# Altium schematic sheet ISense.SchDoc: Current Sense
size 431 x 279 mm; DocumentNumber: 5; SheetNumber: 5; SheetTotal: 18; ENG_APP_DATE: --/--/--; DSN_APP_DATE: --/--/--; CHK_APP_DATE: --/--/--
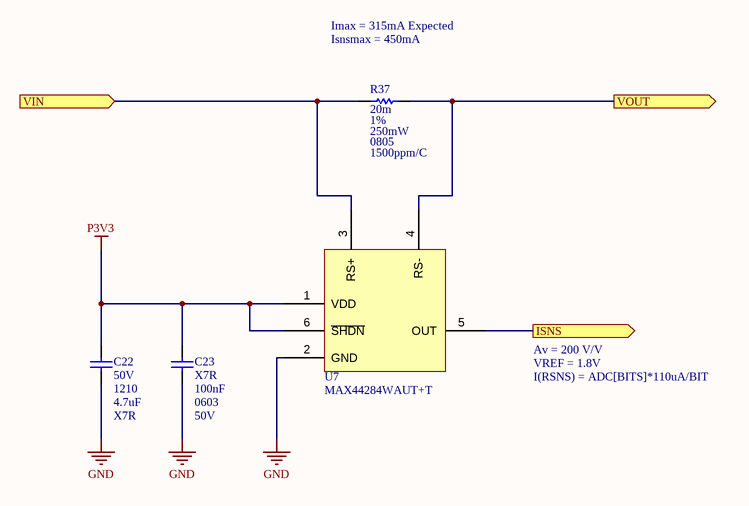
[diagram p0: ISense.SchDoc]

## Parts
C22  value 4.7uF  Voltage Rating: 50V  Case/Package: 1210  Dielectric: X7R  [CAPC3225X270X30ML30]  (hidden comment: Capacitor 4.7uF 10%, 50V, X7R, 1210)
C23  value 100nF  Dielectric: X7R  Case/Package: 0603  Voltage Rating: 50V  [CAPC1608X90X40ML10T20]  (hidden comment: Capacitor 100nF +/- 10%, 50V, X7R, 0603)
R37  value 20m  Power: 250mW  Tolerance: 1%  Case/Package: 0805  TCR: 1500ppm/C  [RESC2013X50X35ML15T15]  (hidden comment: Resistor 20m +/- 1% 0805 250 mW)
U7  MAX44284WAUT+T  [SOT95P280X145-6M]

## Ports
ISNS (out), VIN (in), VOUT (out)

## Nets
GND: C22.1 C23.1 U7.2(GND)
P3V3: C22.2 C23.2 U7.1(VDD) U7.6(~{SHDN})
ISNS: U7.5(OUT) ; port ISNS
VIN: R37.1 U7.3(RS+) ; port VIN
VOUT: R37.2 U7.4(RS-) ; port VOUT

## Notes on the sheet
- Imax = 315mA Expected
- Isnsmax = 450mA
- Av = 200 V/V
- VREF = 1.8V
- I(RSNS) = ADC[BITS]*110uA/BIT
- THIS DOCUMENT AND THE DATA DISCLOSED HEREIN OR HEREWITH IS THE PROPERTY OF APPLIED PHYSICS LAB - UNIVERSITY OF WASHINGTON.
- PROJECT
- TITLE
- FILE NAME
- SIZE
- B
- CAGE CODE
- DWG NO.
- SHEET
- OF
- REV

## Library data of the parts
C22 = CMP-001-00183-10: Chip Capacitor, 4.7uF, 10%, 50 V, X7R 1210 (3225 Metric); Capacitor Type: Ceramic; Decade: 1uF; Tolerance: 10%; Capacitance: 4.7uF; Pins: 2; RoHS Compliant: True; Min Operating Temperature: -55°C; Max Operating Temperature: 125°C; Mount: Surface Mount
C23 = CMP-001-00206-10: Chip Capacitor, 100nF, +/- 10%, 50 V, X7R 0603 (1608 Metric); Capacitor Type: Ceramic; Pins: 2; RoHS Compliant: True; Max Operating Temperature: 125°C; Capacitance: 100nF; Min Operating Temperature: -55°C; Tolerance: 10%; Decade: 100nF; Mount: Surface Mount
R37 = CMP-009-01226-5: Chip Resistor, 20 mOhm, +/- 1%, 125 mW, -55 to 125 degC, 0805 (2012 Metric); Decade: 10m; Voltage Rating: 0.07V; Min Operating Temperature: -55°C; Pins: 2; Max Operating Temperature: 125°C; RoHS Compliant: True; Mount: Surface Mount
U7 = CMP-014-00010-3: -0.1~+36V, High Precision, Low Power Current-Sense Amplifier, 200v/v; -3db Bandwidth: 1kHz; Max Supply Voltage: 5.5V; Min Supply Voltage: 1.7V; Max Operating Temperature: 125°C; Min Operating Temperature: -40°C; Case/Package: SOT-23-6; Gain: 200V/V; Mount: Surface Mount